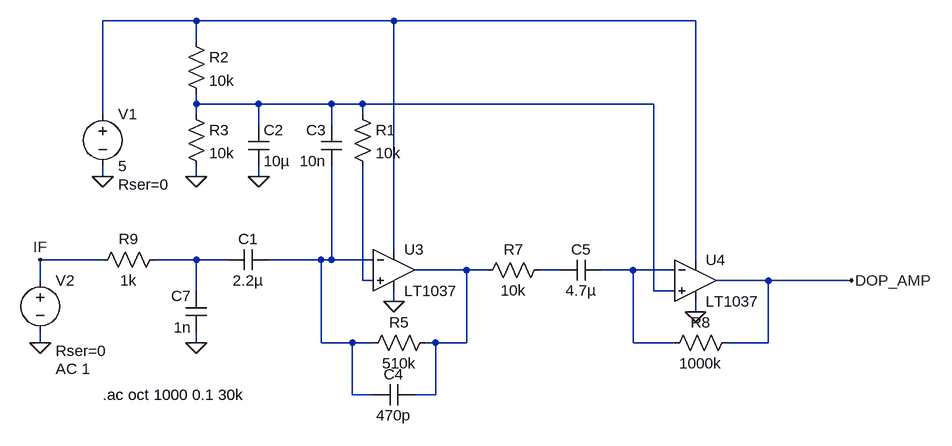
[diagram p0: schematic cdm324-ebay.asc]
cdm324-ebay.asc, the LTspice schematic file:
Version 4
SHEET 1 888 680
WIRE -272 -144 -416 -144
WIRE 32 -144 -272 -144
WIRE 496 -144 32 -144
WIRE -272 -112 -272 -144
WIRE -272 -16 -272 -32
WIRE -176 -16 -272 -16
WIRE -64 -16 -176 -16
WIRE -16 -16 -64 -16
WIRE 432 -16 -16 -16
WIRE -416 0 -416 -144
WIRE -272 0 -272 -16
WIRE -16 0 -16 -16
WIRE -176 16 -176 -16
WIRE -64 16 -64 -16
WIRE -416 96 -416 80
WIRE -272 96 -272 80
WIRE -176 96 -176 80
WIRE 32 208 32 -144
WIRE -416 224 -512 224
WIRE -272 224 -336 224
WIRE -224 224 -272 224
WIRE -80 224 -160 224
WIRE -64 224 -64 80
WIRE -64 224 -80 224
WIRE 0 224 -64 224
WIRE 496 224 496 -144
WIRE 144 240 64 240
WIRE 176 240 144 240
WIRE 288 240 256 240
WIRE 400 240 352 240
WIRE 464 240 400 240
WIRE -512 256 -512 224
WIRE -16 256 -16 80
WIRE 0 256 -16 256
WIRE 608 256 528 256
WIRE 736 256 608 256
WIRE -272 272 -272 224
WIRE 432 272 432 -16
WIRE 464 272 432 272
WIRE 32 288 32 272
WIRE 496 304 496 288
WIRE -512 352 -512 336
WIRE -272 352 -272 336
WIRE -80 352 -80 224
WIRE -32 352 -80 352
WIRE 0 352 -32 352
WIRE 96 352 80 352
WIRE 144 352 144 240
WIRE 144 352 96 352
WIRE 400 352 400 240
WIRE 464 352 400 352
WIRE 608 352 608 256
WIRE 608 352 544 352
WIRE -32 432 -32 352
WIRE 0 432 -32 432
WIRE 96 432 96 352
WIRE 96 432 64 432
FLAG -416 96 0
FLAG -272 352 0
FLAG -272 96 0
FLAG -176 96 0
FLAG -512 224 IF
FLAG 32 288 0
FLAG 496 304 0
FLAG 736 256 DOP_AMP
FLAG -512 352 0
SYMBOL voltage -416 -16 R0
WINDOW 123 0 0 Left 2
WINDOW 39 24 124 Left 2
SYMATTR SpiceLine Rser=0
SYMATTR InstName V1
SYMATTR Value 5
SYMBOL cap -160 208 R90
WINDOW 0 0 32 VBottom 2
WINDOW 3 32 32 VTop 2
SYMATTR InstName C1
SYMATTR Value 2.2µ
SYMBOL res -288 -128 R0
SYMATTR InstName R2
SYMATTR Value 10k
SYMBOL res -288 -16 R0
SYMATTR InstName R3
SYMATTR Value 10k
SYMBOL cap -192 16 R0
SYMATTR InstName C2
SYMATTR Value 10µ
SYMBOL res 96 336 R90
WINDOW 0 0 56 VBottom 2
WINDOW 3 32 56 VTop 2
SYMATTR InstName R5
SYMATTR Value 510k
SYMBOL cap 64 416 R90
WINDOW 0 0 32 VBottom 2
WINDOW 3 32 32 VTop 2
SYMATTR InstName C4
SYMATTR Value 470p
SYMBOL cap 352 224 R90
WINDOW 0 0 32 VBottom 2
WINDOW 3 32 32 VTop 2
SYMATTR InstName C5
SYMATTR Value 4.7µ
SYMBOL res 272 224 R90
WINDOW 0 0 56 VBottom 2
WINDOW 3 32 56 VTop 2
SYMATTR InstName R7
SYMATTR Value 10k
SYMBOL res 560 336 R90
WINDOW 0 0 56 VBottom 2
WINDOW 3 32 56 VTop 2
SYMATTR InstName R8
SYMATTR Value 1000k
SYMBOL voltage -512 240 R0
WINDOW 123 24 152 Left 2
WINDOW 39 24 124 Left 2
SYMATTR Value2 AC 1
SYMATTR SpiceLine Rser=0
SYMATTR InstName V2
SYMATTR Value ""
SYMBOL Opamps\\LT1037 32 176 R0
SYMATTR InstName U3
SYMBOL Opamps\\LT1037 496 192 R0
SYMATTR InstName U4
SYMBOL res -320 208 R90
WINDOW 0 0 56 VBottom 2
WINDOW 3 32 56 VTop 2
SYMATTR InstName R9
SYMATTR Value 1k
SYMBOL cap -256 336 R180
WINDOW 0 24 56 Left 2
WINDOW 3 24 8 Left 2
SYMATTR InstName C7
SYMATTR Value 1n
SYMBOL res -32 -16 R0
SYMATTR InstName R1
SYMATTR Value 10k
SYMBOL cap -48 80 R180
WINDOW 0 24 56 Left 2
WINDOW 3 24 8 Left 2
SYMATTR InstName C3
SYMATTR Value 10n
TEXT -416 432 Left 2 !.ac oct 1000 0.1 30k

The netlist it stands for:
* cdm324-ebay.asc
V1 N001 0 5 Rser=0
C1 N004 N003 2.2µ
R2 N001 N002 10k
R3 N002 0 10k
C2 N002 0 10µ
R5 N005 N004 510k
C4 N005 N004 470p
C5 N007 N006 4.7µ
R7 N006 N005 10k
R8 DOP_AMP N007 1000k
V2 IF 0 AC 1 Rser=0
XU3 N008 N004 N001 0 N005 LT1037  ; pins In+ In- V+ V- OUT
XU4 N002 N007 N001 0 DOP_AMP LT1037  ; pins In+ In- V+ V- OUT
R9 N003 IF 1k
C7 0 N003 1n
R1 N002 N008 10k
C3 N004 N002 10n
.ac oct 1000 0.1 30k
.backanno
.end